# Altium project Flat_Log_PCB.PrjPcb
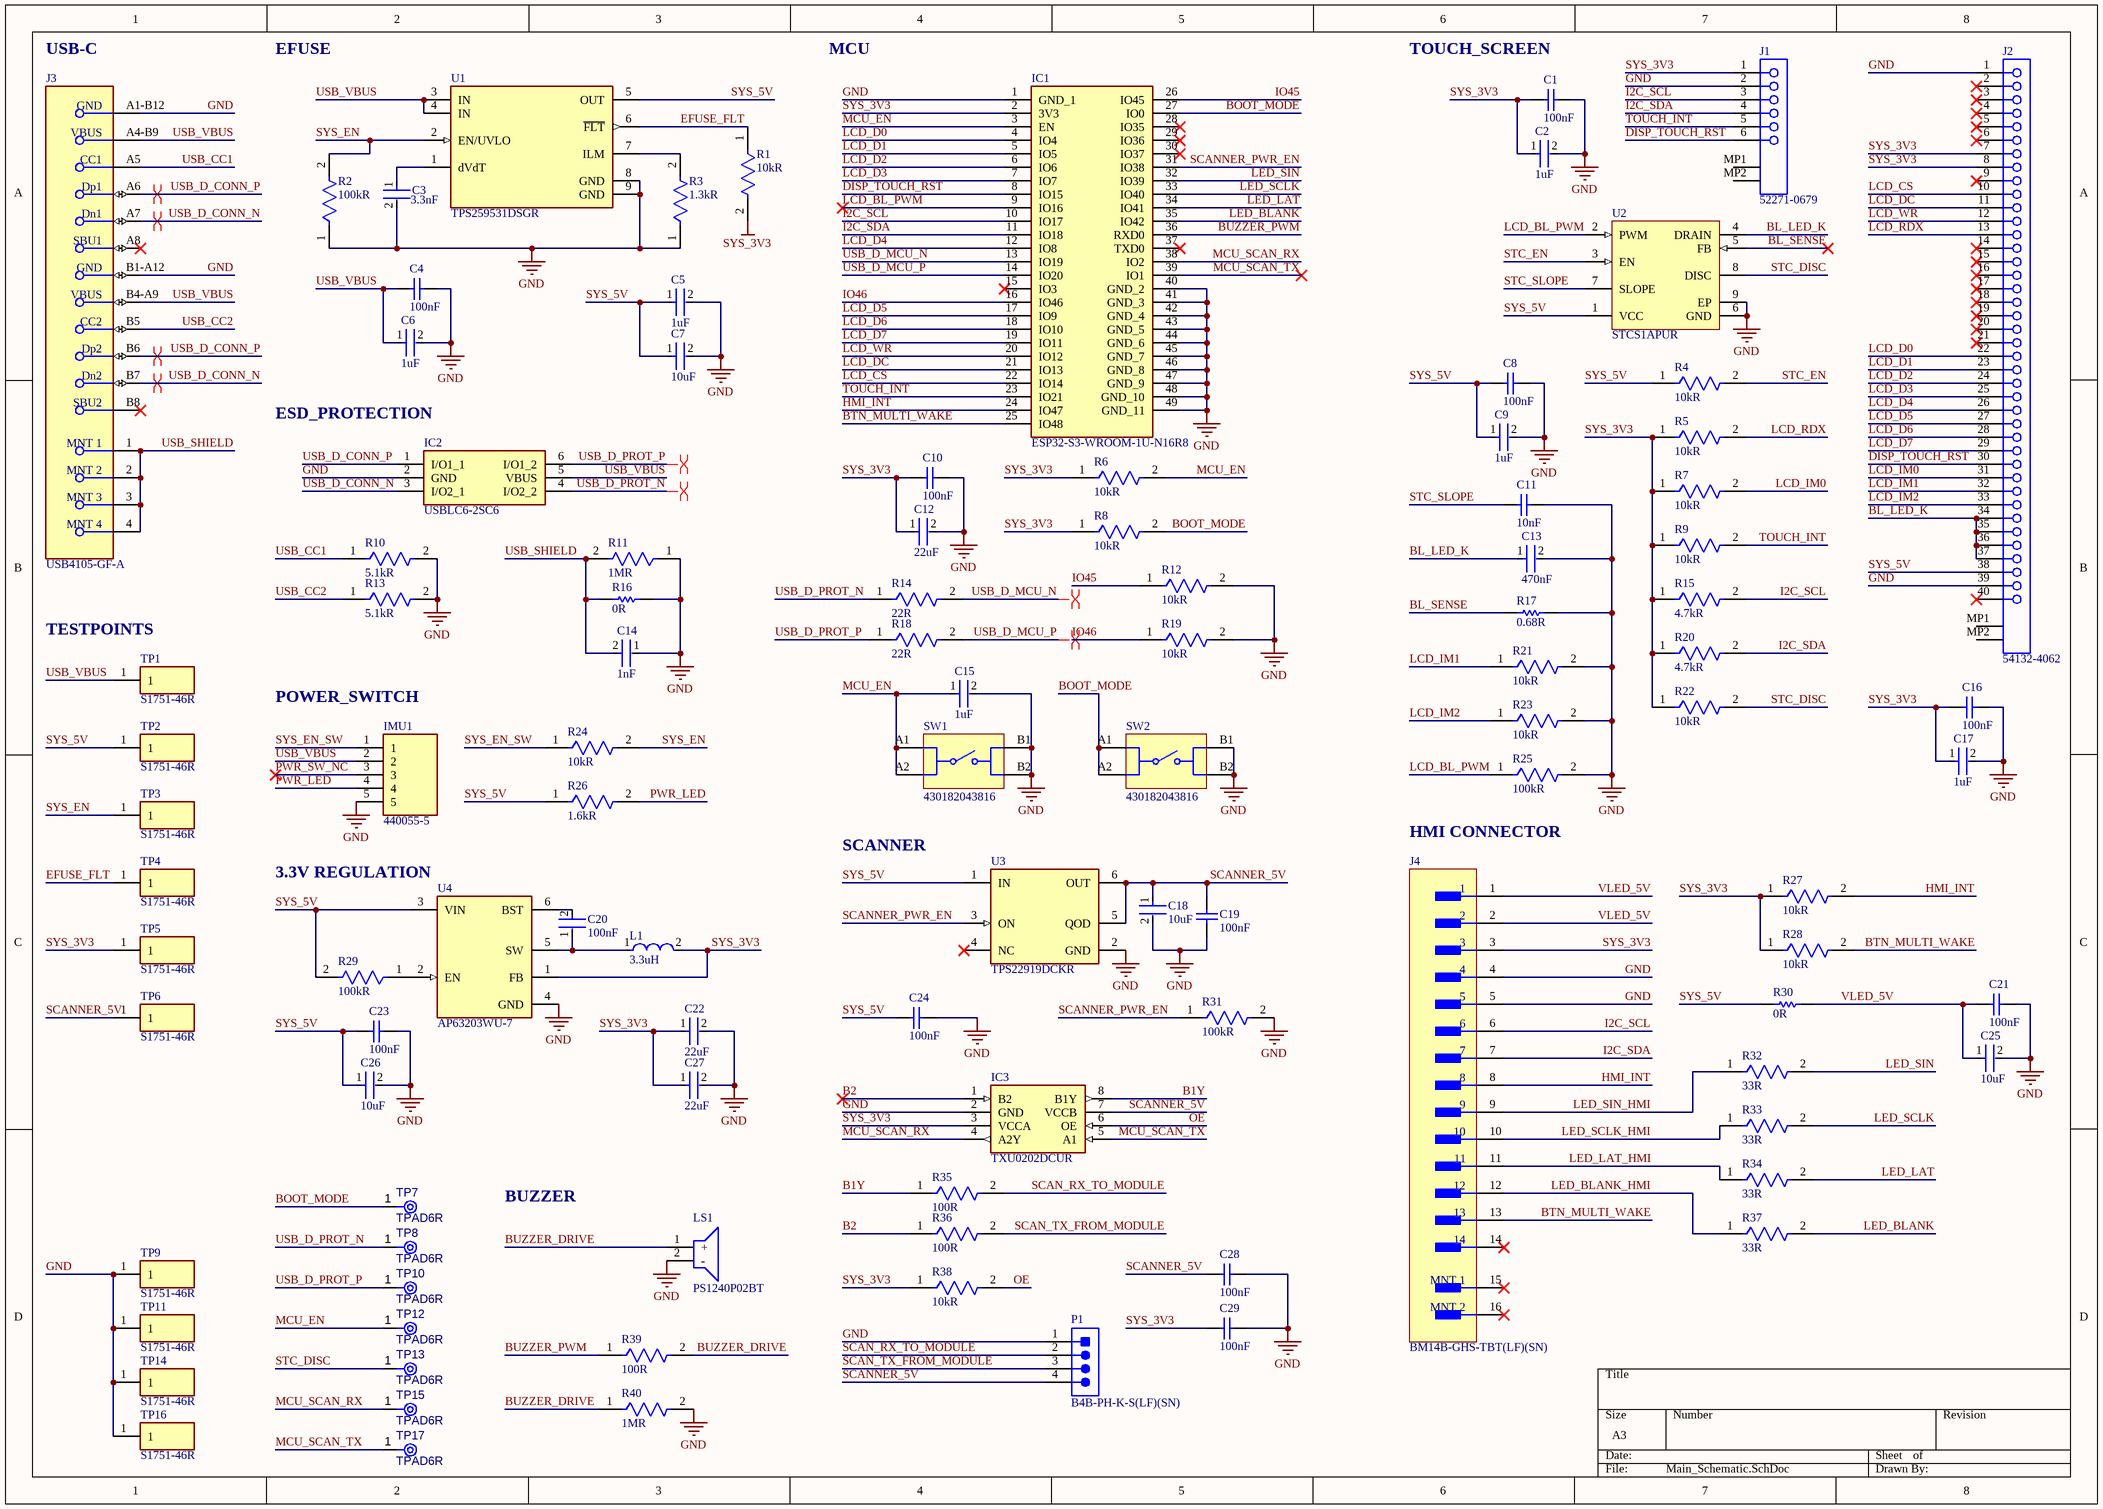
[diagram p0: Main_Schematic.SchDoc]
1 sheet, 103 parts. Net scope: global (net labels, ports and power ports of the same name join across sheets).
Board file: Main_PCB.PcbDoc

## Sheet Main_Schematic.SchDoc
size A3; SheetNumber: 1; SheetTotal: 2

### Parts
C1  100nF  [CAPC1608X90X35ML10T15]
C2  1uF  [FP-GRT188-0_1-e0_2_0_5-IPC_C]
C3  3.3nF  [FP-GCM188-0_1-IPC_A]
C4  100nF  [CAPC1608X90X35ML10T15]
C5  1uF  [FP-GRT188-0_1-e0_2_0_5-IPC_C]
C6  1uF  [FP-GRT188-0_1-e0_2_0_5-IPC_C]
C7  10uF  [FP-GRM21B-0_15-IPC_A]
C8  100nF  [CAPC1608X90X35ML10T15]
C9  1uF  [FP-GRT188-0_1-e0_2_0_5-IPC_C]
C10  100nF  [CAPC1608X90X35ML10T15]
C11  10nF  [CAPC1608X87X35LL15T15]
C12  22uF  [FP-GRM319-0_15-IPC_C]
C13  470nF  [FP-C0603C-CF-MFG]
C14  1nF  [FP-GCJ188-0_2-IPC_A]
C15  1uF  [FP-GRT188-0_1-e0_2_0_5-IPC_C]
C16  100nF  [CAPC1608X90X35ML10T15]
C17  1uF  [FP-GRT188-0_1-e0_2_0_5-IPC_C]
C18  10uF  [FP-GRM21B-0_15-IPC_A]
C19  100nF  [CAPC1608X90X35ML10T15]
C20  100nF  [FP-GCJ188-0_2-IPC_C]
C21  100nF  [CAPC1608X90X35ML10T15]
C22  22uF  [FP-GRM319-0_15-IPC_C]
C23  100nF  [CAPC1608X90X35ML10T15]
C24  100nF  [CAPC1608X90X35ML10T15]
C25  10uF  [FP-GRM21B-0_15-IPC_A]
C26  10uF  [FP-GRM21B-0_15-IPC_A]
C27  22uF  [FP-GRM319-0_15-IPC_C]
C28  100nF  [CAPC1608X90X35ML10T15]
C29  100nF  [CAPC1608X90X35ML10T15]
IC1  ESP32-S3-WROOM-1U-N16R8  [ESP32S3WROOM1UN16R8]
IC2  USBLC6-2SC6  [SOT95P280X145-6N]
IC3  TXU0202DCUR  [SOP50P310X90-8N]
IMU1  440055-5  [4400555]
J1  52271-0679  [MOLX-52271-0679]
J2  54132-4062  [MOLX-54132-4062]
J3  USB4105-GF-A  [FP-USB4105-GF-A-MFG]
J4  BM14B-GHS-TBT(LF)(SN)  [FP-BM14B-GHS-TBT_LF_SN-MFG]
L1  3.3uH  [FP-SRP4020TA-MFG]
LS1  PS1240P02BT  [PS1240P02BT]
P1  B4B-PH-K-S(LF)(SN)  [JST-B4B-PH-K-S_V]
R1  10kR  [FP-AC0603-IPC_A]
R2  100kR  [FP-AC0603-IPC_A]
R3  1.3kR  [FP-RMCF0603-MFG]
R4  10kR  [FP-AC0603-IPC_A]
R5  10kR  [FP-AC0603-IPC_A]
R6  10kR  [FP-AC0603-IPC_A]
R7  10kR  [FP-AC0603-IPC_A]
R8  10kR  [FP-AC0603-IPC_A]
R9  10kR  [FP-AC0603-IPC_A]
R10  5.1kR  [FP-AT0603-IPC_B]
R11  1MR  [FP-RMCF0805-IPC_C]
R12  10kR  [FP-AC0603-IPC_A]
R13  5.1kR  [FP-AT0603-IPC_B]
R14  22R  [FP-RMCF0603-IPC_A]
R15  4.7kR  [FP-RN732A-MFG]
R16  0R  [RESC2013X60X35ML10T20]
R17  0.68R  [RESC1608X55X30NL15T15]
R18  22R  [FP-RMCF0603-IPC_A]
R19  10kR  [FP-AC0603-IPC_A]
R20  4.7kR  [FP-RN732A-MFG]
R21  10kR  [FP-AC0603-IPC_A]
R22  10kR  [FP-AC0603-IPC_A]
R23  10kR  [FP-AC0603-IPC_A]
R24  10kR  [FP-AC0603-IPC_A]
R25  100kR  [FP-AC0603-IPC_A]
R26  1.6kR  [FP-RT0603-MFG]
R27  10kR  [FP-AC0603-IPC_A]
R28  10kR  [FP-AC0603-IPC_A]
R29  100kR  [FP-AC0603-IPC_A]
R30  0R  [RESC2013X60X35ML10T20]
R31  100kR  [FP-AC0603-IPC_A]
R32  33R  [FP-RMCF0805-MFG]
R33  33R  [FP-RMCF0805-MFG]
R34  33R  [FP-RMCF0805-MFG]
R35  100R  [FP-RNCP0603-MFG]
R36  100R  [FP-RNCP0603-MFG]
R37  33R  [FP-RMCF0805-MFG]
R38  10kR  [FP-AC0603-IPC_A]
R39  100R  [FP-RNCP0603-MFG]
R40  1MR  [FP-RMCF0805-IPC_C]
SW1  430182043816  [430182043816]
SW2  430182043816  [430182043816]
TP1  S1751-46R  [S175146R]
TP2  S1751-46R  [S175146R]
TP3  S1751-46R  [S175146R]
TP4  S1751-46R  [S175146R]
TP5  S1751-46R  [S175146R]
TP6  S1751-46R  [S175146R]
TP7  TPAD6R  [TP06R]  (no BOM)
TP8  TPAD6R  [TP06R]  (no BOM)
TP9  S1751-46R  [S175146R]
TP10  TPAD6R  [TP06R]  (no BOM)
TP11  S1751-46R  [S175146R]
TP12  TPAD6R  [TP06R]  (no BOM)
TP13  TPAD6R  [TP06R]  (no BOM)
TP14  S1751-46R  [S175146R]
TP15  TPAD6R  [TP06R]  (no BOM)
TP16  S1751-46R  [S175146R]
TP17  TPAD6R  [TP06R]  (no BOM)
U1  TPS259531DSGR  [FP-DSG0008A-IPC_A]
U2  STCS1APUR  [DFN8(3x3)-P050_N]
U3  TPS22919DCKR  [FP-DCK0006A-MFG]
U4  AP63203WU-7  [FP-TSOT26-MFG]

### Nets
GND: C1.1 C2.2 C3.2 C4.1 C5.2 C6.2 C7.2 C8.1 C9.2 C10.1 C11.2 C12.2 C13.2 C14.1 C15.2 C16.1 C17.2 C18.2 C19.1 C21.1 C22.2 C23.1 C24.1 C25.2 C26.2 C27.2 C28.1 C29.1 IC1.1(GND_1) IC1.40(GND_2) IC1.41(GND_3) IC1.42(GND_4) IC1.43(GND_5) IC1.44(GND_6) IC1.45(GND_7) IC1.46(GND_8) IC1.47(GND_9) IC1.48(GND_10) IC1.49(GND_11) IC2.2(GND) IC3.2(GND) IMU1.5 J1.2 J2.1 J2.39 J3.A1-B12(GND) J3.B1-A12(GND) J4.4 J4.5 LS1.2(-) P1.1 R2.1 R3.1 R10.2 R11.1 R12.2 R13.2 R16.2 R17.2 R19.2 R21.2 R23.2 R25.2 R31.2 R40.2 SW1.B1 SW1.B2 SW2.B1 SW2.B2 TP9.1 TP11.1 TP14.1 TP16.1 U1.8(GND) U1.9(GND) U2.6(GND) U2.9(EP) U3.2(GND) U4.4(GND)
SYS_3V3: C1.2 C2.1 C10.2 C12.1 C16.2 C17.1 C22.1 C27.1 C29.2 IC1.2(3V3) IC3.3(VCCA) J1.1 J2.7 J2.8 J4.3 L1.2 R1.2 R5.1 R6.1 R7.1 R8.1 R9.1 R15.1 R20.1 R22.1 R27.1 R28.1 R38.1 TP5.1 U4.1(FB)
B1Y: IC3.8(B1Y) R35.1
B2: IC3.1(B2) R36.1
BL_LED_K: C13.1 J2.34 J2.35 J2.36 J2.37 U2.4(DRAIN)
BL_SENSE: R17.1 U2.5(FB)
BOOT_MODE: IC1.27(IO0) R8.2 SW2.A1 SW2.A2 TP7.1(TP)
BTN_MULTI_WAKE: IC1.25(IO48) J4.13 R28.2
BUZZER_DRIVE: LS1.1(+) R39.2 R40.1
BUZZER_PWM: IC1.36(RXD0) R39.1
DISP_TOUCH_RST: IC1.8(IO15) J1.6 J2.30
EFUSE_FLT: R1.1 TP4.1 U1.6(~{FLT})
HMI_INT: IC1.24(IO47) J4.8 R27.2
I2C_SCL: IC1.10(IO17) J1.3 J4.6 R15.2
I2C_SDA: IC1.11(IO18) J1.4 J4.7 R20.2
IO45: IC1.26(IO45) R12.1
IO46: IC1.16(IO46) R19.1
LCD_BL_PWM: IC1.9(IO16) R25.1 U2.2(PWM)
LCD_CS: IC1.22(IO14) J2.10
LCD_D0: IC1.4(IO4) J2.22
LCD_D1: IC1.5(IO5) J2.23
LCD_D2: IC1.6(IO6) J2.24
LCD_D3: IC1.7(IO7) J2.25
LCD_D4: IC1.12(IO8) J2.26
LCD_D5: IC1.17(IO9) J2.27
LCD_D6: IC1.18(IO10) J2.28
LCD_D7: IC1.19(IO11) J2.29
LCD_DC: IC1.21(IO13) J2.11
LCD_IM0: J2.31 R7.2
LCD_IM1: J2.32 R21.1
LCD_IM2: J2.33 R23.1
LCD_RDX: J2.13 R5.2
LCD_WR: IC1.20(IO12) J2.12
LED_BLANK: IC1.35(IO42) R37.2
LED_BLANK_HMI: J4.12 R37.1
LED_LAT: IC1.34(IO41) R34.2
LED_LAT_HMI: J4.11 R34.1
LED_SCLK: IC1.33(IO40) R33.2
LED_SCLK_HMI: J4.10 R33.1
LED_SIN: IC1.32(IO39) R32.2
LED_SIN_HMI: J4.9 R32.1
MCU_EN: C15.1 IC1.3(EN) R6.2 SW1.A1 SW1.A2 TP12.1(TP)
MCU_SCAN_RX: IC1.38(IO2) IC3.4(A2Y) TP15.1(TP)
MCU_SCAN_TX: IC1.39(IO1) IC3.5(A1) TP17.1(TP)
OE: IC3.6(OE) R38.2
PWR_LED: IMU1.4 R26.2
PWR_SW_NC: IMU1.3
SCAN_RX_TO_MODULE: P1.2 R35.2
SCAN_TX_FROM_MODULE: P1.3 R36.2
SCANNER_5V: C18.1 C19.2 C28.2 IC3.7(VCCB) P1.4 TP6.1 U3.5(QOD) U3.6(OUT)
SCANNER_PWR_EN: IC1.31(IO38) R31.1 U3.3(ON)
STC_DISC: R22.2 TP13.1(TP) U2.8(DISC)
STC_EN: R4.2 U2.3(EN)
STC_SLOPE: C11.1 U2.7(SLOPE)
SYS_5V: C5.1 C7.1 C8.2 C9.1 C23.2 C24.2 C26.1 J2.38 R4.1 R26.1 R29.2 R30.1 TP2.1 U1.5(OUT) U2.1(VCC) U3.1(IN) U4.3(VIN)
SYS_EN: R2.2 R24.2 TP3.1 U1.2(EN/UVLO)
SYS_EN_SW: IMU1.1 R24.1
TOUCH_INT: IC1.23(IO21) J1.5 R9.2
USB_CC1: J3.A5(CC1) R10.1
USB_CC2: J3.B5(CC2) R13.1
USB_D_CONN_N: IC2.3(I/O2_1) J3.A7(Dn1) J3.B7(Dn2)
USB_D_CONN_P: IC2.1(I/O1_1) J3.A6(Dp1) J3.B6(Dp2)
USB_D_MCU_N: IC1.13(IO19) R14.2
USB_D_MCU_P: IC1.14(IO20) R18.2
USB_D_PROT_N: IC2.4(I/O2_2) R14.1 TP8.1(TP)
USB_D_PROT_P: IC2.6(I/O1_2) R18.1 TP10.1(TP)
USB_SHIELD: C14.2 J3.1(MNT_1) J3.2(MNT_2) J3.3(MNT_3) J3.4(MNT_4) R11.2 R16.1
USB_VBUS: C4.2 C6.1 IC2.5(VBUS) IMU1.2 J3.A4-B9(VBUS) J3.B4-A9(VBUS) TP1.1 U1.3(IN) U1.4(IN)
VLED_5V: C21.2 C25.1 J4.1 J4.2 R30.2
NetC3_1: C3.1 U1.1(dVdT)
NetC20_1: C20.1 L1.1 U4.5(SW)
NetC20_2: C20.2 U4.6(BST)
NetR3_2: R3.2 U1.7(ILM)
NetR29_1: R29.1 U4.2(EN)

Not connected (* = marked no-connect by the designer): IC1 15(IO3)* 28(IO35)* 29(IO36)* 30(IO37)* 37(TXD0)*; J1 MP1 MP2; J2 2* 3* 4* 5* 6* 9* 14* 15* 16* 17* 18* 19* 20* 21* 40* MP1 MP2; J3 A8(SBU1)* B8(SBU2)*; J4 14* 15(MNT_1)* 16(MNT_2)*; U3 4(NC)*

### Layout directives
differential pair: USB_D_CONN_N, USB_D_CONN_P, USB_D_MCU_N, USB_D_MCU_P, USB_D_PROT_N, USB_D_PROT_P

### Notes on the sheet
- USB-C
- EFUSE
- MCU
- (near C1) TOUCH_SCREEN
- ESD_PROTECTION
- (near TP1) TESTPOINTS
- (near IMU1) POWER_SWITCH
- SCANNER
- HMI CONNECTOR
- 3.3V REGULATION
- BUZZER

### Library data of the parts
C1 C4 C8 C10 C16 C19 C21 C23 C24 C28 C29 = CMP-2006-02375-5: Chip Capacitor, 100 nF, +/- 10%, 50 V, -55 to 125 degC, 0603 (1608 Metric), RoHS, Tape and Reel; Manufacturer: Murata; Voltage Rating: 50 V; Min Operating Temperature: -55 degC; ComponentLink1URL: http://www.murata.com/; PackageReference: 0603; Max Operating Temperature: 125 degC; ComponentLink1Description: Manufacturer URL; ComponentLink2Description: Datasheet; Packaging: Tape and Reel; PackageDescription: 2-Pin Surface Mount Device, Body 1.6 x 0.8 mm; Height: 0.8 mm; Mounting Technology: Surface Mount; Mount: Surface Mount; Length: 1.6 mm; ComponentLink2URL: http://psearch.en.murata.com/capacitor/product/GCM188R71H104KA57%23.pdf; Package Quantity: 4000; REACH SVHC: No SVHC; RoHSCompliant: true; DatasheetVersion: 07/2016
C2 C5 C6 C9 C15 C17 = CMP-06035-050353-1: Multi-Layer Ceramic Capacitor 1uF 25V X7R ±10% 0603 Paper T/R
C3 = CMP-06035-061846-1: Ceramic Capacitor for Automotive 3.3nF  ±5% 50VDC C0G 0603 Paper T/R; Voltage Rating (DC): 50V; Max Operating Temperature: 125°C; Tolerance: 5%; Min Operating Temperature: -55°C; Capacitance: 3.3nF; Weight: 0.000222oz; Termination: SMD/SMT; Package Quantity: 10000; Case/Package: 0603; Thickness: 0.035inch; Case Code (Metric): 1608; Mount: Surface Mount; RoHS Compliant: Yes; Packaging: Tape and Reel; Case Code (Imperial): 0603; Height: 0.8mm; Width: 0.031inch; Ratings: AEC-Q200; Voltage Rating: 50V; Length: 0.063inch; Dielectric: C0G
C7 C18 C25 C26 = CMP-06035-013048-1: Chip Multilayer Ceramic Capacitors for General Purpose, 0805, 10uF, X5R, 15%, 20%, 25V; Max Operating Temperature: 85°C; Package Quantity: 3000; Case/Package: 0805; Depth: 1.25mm; Case Code (Imperial): 0805; Termination: SMD/SMT; Width: 0.049inch; Packaging: Tape and Reel; Tolerance: 20%; Height: 1.25mm; Min Operating Temperature: -55°C; Capacitance: 10uF; Weight: 0.000335oz; Voltage Rating (DC): 25V; Dielectric: X5R; Length: 2mm; Thickness: 0.055inch; Voltage Rating: 25V; Resistor Type: Ceramic; Lead Free: Lead Free; Case Code (Metric): 2012; Mount: Surface Mount; REACH SVHC: No SVHC
C11 = CMP-2006-03035-1: Manufacturer: Kemet; Part Number: C0603C103J5RALTU
C12 C22 C27 = CMP-06035-037955-1: Chip Multilayer Ceramic Capacitors for General Purpose, 1206, 22uF, X5R, 15%, 20%, 16V; Weight: 0.001411oz; Case/Package: 1206; Mount: Surface Mount; Voltage Rating (DC): 16V; Case Code (Metric): 3216; Height: 0.85mm; Package Quantity: 4000; Resistor Type: Ceramic; Thickness: 0.037inch; Packaging: Tape and Reel; Dielectric: X5R; Tolerance: 20%; Capacitance: 22uF; Case Code (Imperial): 1206; Width: 0.063inch; Termination: SMD/SMT; Voltage Rating: 16V; Length: 0.126inch; Min Operating Temperature: -55°C; Max Operating Temperature: 85°C
C13 = CMP-03020-000294-1: CAP CER SMD 0603 .47UF 5% X7R 16; Manufacturer: KEMET; Manufacturer Part Number: C0603C474J4RACAUTO; Capacitance: 0.47 μF; Material: Ceramic; Tolerance: 0.05; Automotive Grade: Grade 1; Value: 0.47 μF; Temperature Coefficient: 30ppm/°C; Voltage Rating: 16 V; Height: 0.87mm; Device Class L2: Capacitors; RoHS: TRUE; Mouser Description: Multilayer Ceramic Capacitor Automotive Grad X7R 0.47uF 5% 16V SMD 0603 Paper T/R; ComponentLink2URL: https://api.kemet.com/component-edge/download/datasheet/C0603C100J5GACAUTO.pdf; Device Class L1: Passive Components; Package: C0603C-CF; Octopart: https://octopart.com/c0603c474j4racauto-kemet-80813680; Lead Free: Yes; Temperature Characteristic: X7R; ComponentLink2Description: Datasheet; Digikey Description: CAP CER SMD 0603 .47UF 5% X7R 16; Automotive: Yes; Device Class L3: Ceramic Capacitors; Temperature Range Low: -55°C; Temperature: -55°C to +125°C; Category: Cap; Temperature Range High: +125°C
C14 = CMP-2006-02221-2: Cap Ceramic 1000pF 50V X7R 10% Pad SMD 0603 Soft Termination +125°C Automotive T/R; Mount: Surface Mount; Packaging: Tape and Reel; Voltage Rating: 50V; Capacitance: 1nF; Package Quantity: 4000; Tolerance: 10%; Case Code (Metric): 1608; Width: 0.031inch; Termination: SMD/SMT; Thickness: 0.031inch; Case/Package: 0603; Features: Soft Termination; Lead Free: Lead Free; Dielectric: X7R; Voltage Rating (DC): 50V; Case Code (Imperial): 0603; Max Operating Temperature: 125°C; Length: 0.063inch; Ratings: AEC-Q200; Min Operating Temperature: -55°C
C20 = CMP-2006-02223-2: Cap Ceramic 0.1uF 50V X7R 10% Pad SMD 0603 Soft Termination +125°C Automotive T/R; Radiation Hardening: No; Dielectric: X7R; Voltage Rating (DC): 50V; Case Code (Imperial): 0603; Length: 1.6mm; Features: Soft Termination; Case Code (Metric): 1608; Case/Package: 0603; Termination: SMD/SMT; Packaging: Tape and Reel; Height: 0.8mm; Tolerance: 10%; Thickness: 0.035inch; Width: 0.031inch; Voltage Rating: 50V; Min Operating Temperature: -55°C; Ratings: AEC-Q200; Package Quantity: 1; Capacitance: 100nF; Depth: 0.8mm; Mount: Surface Mount; Lead Free: Lead Free; Max Operating Temperature: 125°C
IC1 = ESP32-S3-WROOM-1U-N16R8: Integrated Circuit; Manufacturer_Name: Espressif Systems; Datasheet Link: https://www.espressif.com/sites/default/files/documentation/esp32-s3-wroom-1_wroom-1u_datasheet_en.pdf; Height: 3.35mm; Manufacturer_Part_Number: ESP32-S3-WROOM-1U-N16R8; Mouser Part Number: 356-ESP32S3WM1UN16R8; Mouser Price/Stock: https://www.mouser.co.uk/ProductDetail/Espressif-Systems/ESP32-S3-WROOM-1U-N16R8?qs=Li%252BoUPsLEns6V0Pr5KRJtw%3D%3D
IC2 = USBLC6-2SC6: Integrated Circuit; Manufacturer_Name: STMicroelectronics; Datasheet Link: https://www.st.com/resource/en/datasheet/usblc6-2.pdf; Height: 1.45mm; Manufacturer_Part_Number: USBLC6-2SC6; Mouser Part Number: 511-USBLC6-2SC6; Mouser Price/Stock: https://www.mouser.co.uk/ProductDetail/STMicroelectronics/USBLC6-2SC6?qs=po45yt2pPpu%2FhNIlwQdTlg%3D%3D; Arrow Part Number: USBLC6-2SC6; Arrow Price/Stock: https://www.arrow.com/en/products/usblc6-2sc6/stmicroelectronics?utm_currency=USD&region=europe
IC3 = TXU0202DCUR: Integrated Circuit; Manufacturer_Name: Texas Instruments; Datasheet Link: https://www.ti.com/product/ja-jp/TXU0202; Height: 0.9mm; Manufacturer_Part_Number: TXU0202DCUR; Mouser Part Number: 595-TXU0202DCUR; Mouser Price/Stock: https://www.mouser.co.uk/ProductDetail/Texas-Instruments/TXU0202DCUR?qs=t7xnP681wgVssPLUozppFA%3D%3D; Arrow Part Number: TXU0202DCUR; Arrow Price/Stock: https://www.arrow.com/en/products/txu0202dcur/texas-instruments.html?utm_currency=USD&region=nac
IMU1 = 440055-5: Connector; Manufacturer_Name: TE Connectivity; Datasheet Link: https://www.te.com/commerce/DocumentDelivery/DDEController?Action=srchrtrv&DocNm=1-1773713-2_HPI_QRG_EN&DocType=Data%20Sheet&DocLang=English&PartCntxt=440055-5&DocFormat=pdf; Height: 5.25mm; Manufacturer_Part_Number: 440055-5; Mouser Part Number: 571-440055-5; Mouser Price/Stock: https://www.mouser.co.uk/ProductDetail/TE-Connectivity/440055-5?qs=DE9Qji9blsSCZ1TIZpnBjw%3D%3D; Arrow Part Number: 440055-5; Arrow Price/Stock: https://www.arrow.com/en/products/440055-5/te-connectivity?region=nac
J1 = CMP-1241-00227-1: 1.0 mm Pitch Easy-On(TM) Type FPC Connector, 3.0 mm Mated Height, Right Angle, ZIF, SMT, Bottom Contact, 6 Circuits, -40 to 85 degC, ELV and RoHS Compliant, Tape and Reel; Manufacturer: Molex; Material - Plating Termination: Tin-Bismuth; Pitch - Mating Interface: 1.00mm; Voltage (Max): 50V AC (RMS)/DC; Durability (mating cycles max): 30; Mated Height: 3.00mm; PCB Locator: No; Polarized to PCB: Yes; Material - Metal: Phosphor Bronze; Current (Max per Contact): 0.5A; Circuits (Loaded): 6; Entry Angle: 90degrees Angle; ComponentLink1Description: Manufacturer URL; PackageVersion: Rev. B, 04/2004; PackageDescription: 6-Lead FPC Connector, Pitch 1.0 mm; Packing: Tape and Reel; Contact Position: Bottom; Material - Plating Mating: Tin-Bismuth; PackageReference: 52271-0679; RoHS: TRUE; ComponentLink2Description: Datasheet; ComponentLink1URL: http://www.molex.com/molex/index.jsp; PartNumber: 52271-0679; Pitch - Termination Interface: 1.00mm; ComponentLink3URL: http://www.molex.com/pdm_docs/sd/522710679_sd.pdf; Orientation: Right Angle; Number of Rows: 1; Stackable: No; PCB Retention: Yes; Mounting Technology: Surface Mount; ComponentLink3Description: Package Specification; ComponentLink2URL: http://www.molex.com/webdocs/datasheets/pdf/en-us/0522710679_FFC_FPC_CONNECTORS.pdf
J2 = CMP-1241-00531-1: 0.5 mm Pitch Easy-On(TM) Type FPC Connector, 2.0 mm Mated Height, Right Angle, ZIF, SMT, Bottom Contact, 40 Circuits, -20 to 85 degC, ELV and RoHS Compliant, Tape and Reel; Manufacturer: Molex; Material - Plating Termination: Gold; Stackable: No; Pitch - Mating Interface: 0.50mm; Polarized to PCB: Yes; Material - Metal: Phosphor Bronze; Durability (mating cycles max): 20; Entry Angle: 90degrees Angle; Current (Max per Contact): 0.5A; Circuits (Loaded): 40; Mated Height: 2.00mm; Voltage (Max): 50V; PartNumber: 54132-4062; PackageReference: 54132-4062; PCB Locator: No; Orientation: Right Angle; ComponentLink3URL: http://www.molex.com/pdm_docs/sd/541324062_sd.pdf; ComponentLink3Description: Package Specification; PCB Retention: Yes; ComponentLink1Description: Manufacturer URL; Number of Rows: 1; RoHS: TRUE; Contact Position: Bottom; PackageDescription: 40-Lead FPC Connector, Pitch 0.5 mm; PackageVersion: Rev. F, 07/2010; Mounting Technology: Surface Mount; ComponentLink2Description: Datasheet; ComponentLink1URL: http://www.molex.com/molex/index.jsp; Packing: Tape and Reel; Material - Plating Mating: Gold; ComponentLink2URL: http://www.molex.com/webdocs/datasheets/pdf/en-us/0541324062_FFC_FPC_CONNECTORS.pdf
J3 = CMP-245163-000001-1: CONN RCPT USB2.0 TYPEC 5A; Manufacturer: GCT; Voltage Rating: 20V; Is Female: yes; Current Rating: 5/6.25/1.25/0.25A; Number Of Contacts: 16; Conn Orientation: Right Angle; Device Class L1: Connectors; Category: Conn; Lead Free: Yes; RoHS: TRUE; Temperature Range High: +85°C; Digikey Description: CONN RCPT USB2.0 TYPEC 5A; Device Class L3: unset; ComponentLink2Description: Datasheet; Manufacturer Part Number: USB4105-GF-A; Package: 0; Usb Standard: USB 2.0; Device Class L2: USB Connectors; Automotive: No; Temperature Range Low: -40°C; Height: 3.46mm; Temperature: -40°C to +85°C; Contact Material: Gold,Nickel; ComponentLink2URL: https://gct.co/files/drawings/usb4105.pdf; Octopart: https://octopart.com/usb4105-gf-a-gct-106627878
J4 = CMP-00504-00289289-1: BM14B-GHS-TBT(LF)(SN) Conn Shrouded Header HDR 14 POS 1.25mm Solder ST Top Entry SMD T/R; NexarPartId: 289289; Connector Type: Male Pin; Voltage Rating: 50V; Pitch: 1.2446mm; Number of Contacts: 14; Current Rating: 1A; Number of Rows: 1; Housing Material: Nylon; Height: 4.2mm; Max Operating Temperature: 85°C; RoHS: Compliant; Contact Material: Copper, Tin; Color: Natural; Housing Color: Natural; Mount: Surface Mount; Packaging: Cut Tape; Lead Free: Lead Free; Termination: Solder; Contact Plating: Tin; Min Operating Temperature: -25°C; Number of Positions: 14; Fastening Type: Latch
L1 = CMP-07248-000008-1: FIXED IND 3.3UH 3.5A 76 MOHM SMD; Manufacturer: Bourns; Manufacturer Part Number: SRP4020TA-3R3M; Shielding: true; Test Frequency: 100kHz; Self Resonant Frequency: 40MHz; Saturation Current: 4A; Q Factor: 10; Series Resistance: 76mΩ; Automotive Grade: Grade 0; Core Material: Carbonyl Powder; Tolerance: 20%; Temperature Range High: +150°C; Height: 2.1mm; Temperature: -40°C to +150°C; RoHS: TRUE; Device Class L3: Fixed Inductors; Automotive: Yes; Octopart: https://octopart.com/srp4020ta-3r3m-bourns-47300338; Composition: Wirewound; Mouser Description: Ind Power Shielded Wirewound 3.3uH 20% 100KHz Carbonyl Powder 3.5A T/R; Category: Ind; ComponentLink2Description: Datasheet; ComponentLink2URL: https://www.bourns.com/docs/Product-Datasheets/SRP4020TA.pdf; Digikey Description: FIXED IND 3.3UH 3.5A 76 MOHM SMD; Lead Free: Yes; Temperature Range Low: -40°C; Inductance: 3.3uH; Rms Current: 3.5A; Package: SRP4020TA; Value: 3.3uH; Device Class L1: Passive Components; Device Class L2: Inductors
LS1 = PS1240P02BT: Loudspeaker or Buzzer; Manufacturer_Name: TDK; Datasheet Link: https://product.tdk.com/system/files/dam/doc/product/sw_piezo/sw_piezo/piezo-buzzer/catalog/piezoelectronic_buzzer_ps_en.pdf; Manufacturer_Part_Number: PS1240P02BT; Mouser Part Number: 810-PS1240P02BT; Mouser Price/Stock: https://www.mouser.co.uk/ProductDetail/TDK/PS1240P02BT?qs=d7g9p1yFhWaZXSY9MjKMkw%3D%3D; Arrow Part Number: PS1240P02BT; Arrow Price/Stock: https://www.arrow.com/en/products/ps1240p02bt/tdk?utm_currency=USD&region=nac
P1 = CMP-2000-05165-1: Male Header, Pitch 2 mm, 1 x 4 Position, Height 6 mm, Tail Length 3.4 mm, -25 to 85 degC, RoHS, Bulk; Manufacturer: JST; No of Positions: 4; Style/Orientation: StraightHeader/Plug; Pitch: 2mm; Datasheet URL: http://datasheet.octopart.com/B4B-PH-K-S%28LF%29%28SN%29-JST-datasheet-10558886.pdf; Type: ShroudedHeader; Manufacturer URL: http://www.jst.com/home2.html; Termination: Crimp; Datasheet Version: Apr-09
R1 R4-R9 R12 R19 R21-R24 R27 R28 R38 = CMP-03412-040683-1: RES 10kΩ 5.00% 0.2W 0603
R2 R25 R29 R31 = CMP-03412-043770-1: RES 100kΩ 1.00% 0.2W 0603
R3 = CMP-26527-000647-1: 1.3kΩ ±5% 0.1W 0603 Thick Film Chip Resistor AEC-Q200 compliant; Temperature Coefficient: 100ppm/°C; Resistor Type: Thick Film; RoHS Compliant: Yes; Max Operating Temperature: 155°C; Tolerance: 5%; Resistance: 1.3kR; Mount: Surface Mount; Radiation Hardening: No; Packaging: Tape and Reel; Contact Plating: Tin; Min Operating Temperature: -55°C; Case/Package: 0603
R10 R13 = CMP-03412-047308-1: Thin Film Chip Resistors Automotive Grade 5.1kΩ 1% 50ppm/°C 0603
R11 R40 = CMP-26527-000066-1: 1MΩ ±5% 0.125W 0805 Thick Film Chip Resistor AEC-Q200 compliant; Temperature Coefficient: 200ppm/°C; Max Power Dissipation: 125mW; Construction: Rectangular; Case Code (Metric): 2012; Radiation Hardening: No; Contact Plating: Tin; Military Standard: Not; Features: Automotive AEC-Q200; Resistor Type: Thick Film; Series: RMCF; Length: 2mm; Min Operating Temperature: -55°C; Case Code (Imperial): 0805; Height: 0.026inch; Mount: Surface Mount; Max Operating Temperature: 155°C; Depth: 1.25mm; Width: 0.049inch; Packaging: Tape and Reel; Number of Terminations: 2; Case/Package: 0805; Tolerance: 5%; Lead Free: Lead Free; RoHS Compliant: Yes; Resistance: 1MR
R14 R18 = CMP-26527-002321-1: 22Ω ±5% 0.1W 0603 Thick Film Chip Resistor AEC-Q200 compliant; Temperature Coefficient: 200ppm/°C; Max Power Dissipation: 100mW; Packaging: Tape and Reel; Resistance: 22R; Radiation Hardening: No; Tolerance: 5%; Min Operating Temperature: -55°C; Height: 0.022inch; Case/Package: 0603; Width: 0.031inch; Contact Plating: Tin; Max Operating Temperature: 155°C; Mount: Surface Mount; Resistor Type: Thick Film; Number of Terminations: 2; Series: RMCF; Features: Automotive AEC-Q200; Length: 0.061inch; RoHS Compliant: Yes
R15 R20 = CMP-03211-000377-1: SMD Chip Resistor, Thin Film, 4.7KΩ, 100 V, 0805 [2012 Metric], 100 mW, 0.1%, RN73 Series; Manufacturer: TE Connectivity; Manufacturer Part Number: RN73C2A4K7BTDF; Temperature Coefficient: 10ppm/°C; Power Rating: 0.1W; Voltage Rating: 100V; Package: RN732A; Tolerance: 0.1%; Automotive: No; Series: RN73; Device Class L2: Resistors; Lead Free: Yes; Device Class L3: Chip SMD Resistors; Temperature Range Low: -55°C; Temperature Range High: 155°C; Ipc Land Pattern Name: RESC200125X55; Value: 4.7KΩ; ComponentLink2Description: Datasheet; ComponentLink2URL: https://www.te.com/commerce/DocumentDelivery/DDEController?Action=showdoc&DocId=Data+Sheet%7F1773270%7FP%7Fpdf%7FEnglish%7FENG_DS_1773270_P.pdf%7F1676162-2; Device Class L1: Passive Components; Resistance: 4.7KΩ; packaging: 1000 Reel; Height: 0.65mm; octopart_url: https://octopart.com/rn73c2a4k7btdf-te+connectivity-22737749; Temperature: -55°C to 155°C; Octopart: https://octopart.com/rn73c2a4k7btdf-te+connectivity-22737749; RoHS: TRUE; Composition: Thin Film; Category: Res
R16 R30 = CMP-2100-03673-1: Chip Resistor, 0 Ohm, Jumper, +/- 5%, 0.125 W, -55 to 155 degC, 0805 (2012 Metric), RoHS, Tape and Reel; Manufacturer: Yageo; Power Rating: 125mW; Resistance: 0mOhm; Voltage Rating (DC): 150V; Temperature Coefficient: 200ppm/degreesC; Height: 0.5mm; Depth: 1.25mm; Case Code (Imperial): 0805; Lead Free: LeadFree; Military Standard: Not; Package Description: 2-Pin Surface Mounted Device, Body 2 x 1.25 mm; Case Code (Metric): 2012; Composition: ThickFilm; Voltage Rating: 150V; Manufacturer URL: http://www.yageo.com/; Packaging: TapeandReel; Package Reference: 0805; REACH SVHC: Unknown; Tolerance: 5%; Case/Package: 0805; Max Operating Temperature: 155degC; Number of Pins: 2; Min Operating Temperature: -55degC; RoHSCompliant: true; Length: 2mm; Datasheet URL: http://www.yageo.com/NewPortal/yageodocoutput?fileName=/pdf/R-Chip/PYu-RC_Group_51_RoHS_L_5.pdf; Termination: SMD/SMT; Radiation Hardening: No; Width: 1.25mm; Contact Plating: Tin; Datasheet Version: Rev. 5, 10/2016
R17 = CMP-2000-00859-1: Part Number: ERJ-3RQFR68V; Manufacturer: Panasonic
R26 = CMP-2000-04678-2: RES SMD 1.6K OHM 1% 1/10W 0603; Manufacturer Part Number: RT0603FRE071K6L; Manufacturer: Yageo; Tolerance: 0.01; Power Rating: 0.1W; Temperature Coefficient: 50 ppm/°C; Value: 1.6KΩ; Voltage Rating: 75V; Footprint Url: http://www.yageo.com/exep/pages/download/literatures/PYu-R_Mount_10.pdf; Device Class L1: Passive Components; Temperature Range High: +155°C; Height: 0.55mm; Category: Res; Automotive: No; ComponentLink2Description: Datasheet; ComponentLink2URL: http://www.yageo.com/documents/recent/PYu-RT_1-to-0.01_RoHS_L_9.pdf; RoHS: TRUE; Device Class L2: Resistors; Package: RT0603; Series: RT; Composition: Thin Film; Temperature Range Low: -55°C; Device Class L3: Chip SMD Resistors; Lead Free: Yes; Temperature: -55°C to +155°C; Mouser Description: Res Thin Film 0603 1.6K Ohm 1% 1/10W ±50ppm/°C Molded SMD SMD Paper T/R; Octopart: https://octopart.com/rt0603fre071k6l-yageo-1421906; Resistance: 1.6KΩ; Ipc Land Pattern Name: RESC16080X45; Digikey Description: RES SMD 1.6K OHM 1% 1/10W 0603
R32-R34 R37 = CMP-26527-003272-1: 33Ω ±1% 0.125W 0805 Thick Film Chip Resistor AEC-Q200 compliant; Max Power Dissipation: 125mW; Temperature Coefficient: 100ppm/°C; Height: 0.026inch; Resistance: 33R; Contact Plating: Tin; Features: Automotive AEC-Q200; RoHS Compliant: Yes; Number of Terminations: 2; Min Operating Temperature: -55°C; Length: 0.079inch; Case/Package: 0805; Case Code (Metric): 2012; Series: RMCF; Width: 0.049inch; Mount: Surface Mount; Radiation Hardening: No; Case Code (Imperial): 0805; Tolerance: 1%; Packaging: Tape and Reel; Max Operating Temperature: 155°C; Resistor Type: Thick Film
R35 R36 R39 = CMP-26527-000148-1: 100Ω ±1% 0.125W 0603 High Power Anti-Sulfur Thin Film Chip Resistor; Temperature Coefficient: 100ppm/°C; Max Power Dissipation: 125mW; Features: Moisture Resistant; Packaging: Tape and Reel; Lead Free: Lead Free; Resistance: 100R; Height: 0.02inch; Series: RNCP; Contact Plating: Tin; Resistor Type: Thin Film; Case Code (Imperial): 0603; Case Code (Metric): 1608; Min Operating Temperature: -55°C; Length: 0.059inch; Number of Terminations: 2; RoHS Compliant: Yes; Tolerance: 1%; Width: 0.031inch; Max Operating Temperature: 155°C; Case/Package: 0603; Mount: Surface Mount; Radiation Hardening: No
SW1 SW2 = CMP-1452-00013-5: Switch Tactile N.O. SPST Round Button Gull Wing 0.05A 12VDC 1000000Cycles 1.57N SMD Reel; Actuator Length: 900µm; Current Rating: 50mA; Switch Travel: 250µm; Switch Function: Off-Mom; Contact Resistance: 100mΩ; Mechanical Life: 1Mcycles; Voltage Rating: 12V; Illumination Type: Illuminated, Non-Illuminated; Actuator Material: Liquid Crystal Polymer, Polymer; Mount: Surface Mount; Length: 6.2mm; Diameter: 3.5mm; Packaging: Tape and Reel; Throw Configuration: SPST; Contact Plating: Silver; REACH SVHC: No; Termination: Gull Wing; Color: Black; Contact Material: Stainless Steel, Steel; Lead Free: Lead Free; Contact Current Rating: 50mA; Min Operating Temperature: -40°C; Height: 4.3mm; Insulation Resistance: 100MΩ; RoHS: Compliant; Max Operating Temperature: 85°C; Width: 6.2mm
TP1-TP6 TP9 TP11 TP14 TP16 = S1751-46R: Test Point; Manufacturer_Name: Harwin; Datasheet Link: https://content.harwin.com/m/c5b84e6a45e9b9f6/original/DRG-02202-Technical-Drawing-Datasheet-S1751R-pdf.pdf; Height: 2mm; Manufacturer_Part_Number: S1751-46R; Mouser Part Number: 855-S1751-46R; Mouser Price/Stock: https://www.mouser.co.uk/ProductDetail/Harwin/S1751-46R?qs=l6ZPVqNVZb71wETAKrfRig%3D%3D
TP7 TP8 TP10 TP12 TP13 TP15 TP17 = CMP-00028-00002-2: 0.6mm round; Pins: 1
U1 = CMP-04913-000052-1: IC PWR MGMT EFUSE 2.7-18V 8WSON; Number of Channels: 1; Accuracy: 7.5%; Output Current: 4A; RoHS Compliant: Yes; Packaging: Cut Tape; Mount: Surface Mount; Max Operating Temperature: 125°C; Min Operating Temperature: -40°C
U2 = CMP-0244-00276-1: 1.5A Max Constant Current LED driver, 8-Pin VDFPN, Tape and Reel; PackageDescription: 8-Pin Dual Flat No-Lead, 3 x 3 x 1 mm Body, 0.5 mm Pitch, Exposed Pad; ComponentLink2URL: http://www.st.com/internet/com/TECHNICAL_RESOURCES/TECHNICAL_LITERATURE/DATASHEET/CD00185793.pdf; PackageVersion: 2008; ComponentLink1URL: http://www.st.com; ComponentLink1Description: Manufacturer URL; PackageReference: DFN8(3x3)-P050; DatasheetVersion: 1/07/2008; ComponentLink2Description: Datasheet
U3 = CMP-04912-000027-1: POWER MANAGEMENT
U4 = CMP-12757-000006-1: IC REG BUCK 3.3V 2A TSOT26; Manufacturer: Diodes Inc.; Output Type: Fixed; Min Supply Voltage: 3.8V; Number Of Outputs: 1; Max Junction Temp: +160°C; Nominal Supply Current: 22uA; Standoff Height: 0.01mm; Switching Frequency: 1.1MHz; Max Supply Voltage: 32V; ComponentLink2Description: Datasheet; Device Class L1: Integrated Circuits (ICs); Temperature: to +160°C; Device Class L3: Voltage Regulators - Switching; RoHS: TRUE; Octopart: https://octopart.com/ap63203wu-7-diodes+inc.-98099550; Output Voltage: 3.3V; Lead Free: Yes; ComponentLink2URL: https://www.diodes.com/assets/Datasheets/AP63200-AP63201-AP63203-AP63205.pdf; Digikey Description: IC REG BUCK 3.3V 2A TSOT26; Footprint Url: https://www.diodes.com/assets/Package-Files/TSOT26.pdf; Ambient Temperature Range High: +85°C; Height: 1mm; Automotive: No; Temperature Range High: +160°C; Switching Topology: Buck; Output Current: 2A; Package: TSOT26; Category: IC; Mouser Description: AP63203 Series 3.3 V 2 A SMT Fixed Low IQ Synchronous Buck - TSOT-26; Device Class L2: Power Management ICs; Ambient Temperature Range Low: -40°C; Manufacturer Part Number: AP63203WU-7